# Altium schematic sheet lipo-supply.SchDoc
size A
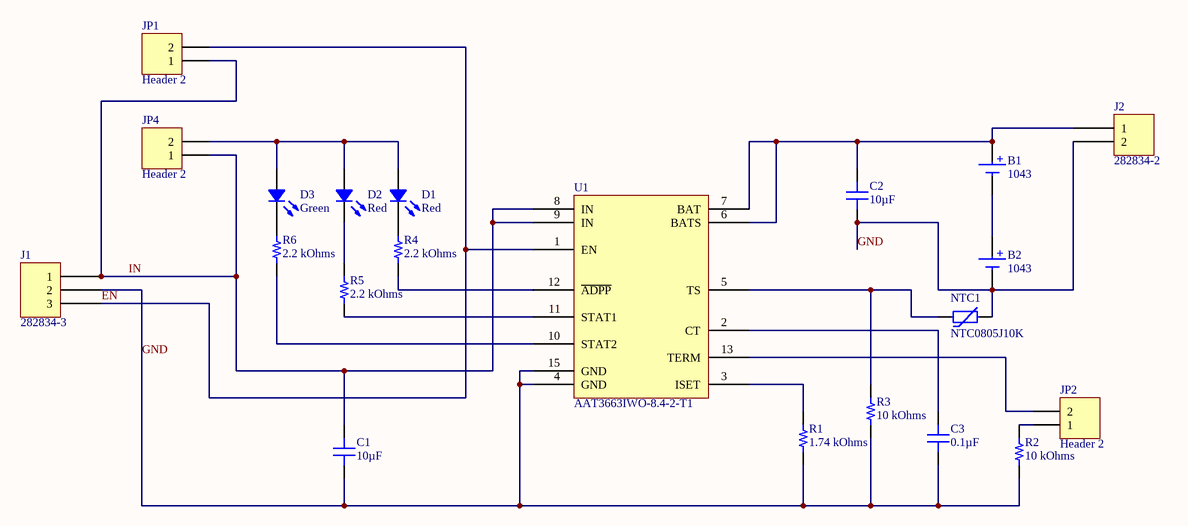
[diagram p0: lipo-supply.SchDoc]

## Parts
B1  1043  [KEYSTONE 1043]
B2  1043  [KEYSTONE 1043]
C1  10µF  [CAP 1210_3225 - 2.8MM]
C2  10µF  [CAP 0805_2012]
C3  0.1µF  [CAP 0805_2012]
D1  Red  [LED 0805_2012 RED]
D2  Red  [LED 0805_2012 RED]
D3  Green  [LED 0805_2012 GREEN]
J1  282834-3  [TE 282834-3]
J2  282834-2  [TE 282834-2]
JP1  Header 2  [HDR1X2]
JP2  Header 2  [HDR1X2]
JP4  Header 2  [HDR1X2]
NTC1  NTC0805J10K  [NTC 0805_2012]
R1  1.74 kOhms  [RES 0805_2012]
R2  10 kOhms  [RES 0805_2012]
R3  10 kOhms  [RES 0805_2012]
R4  2.2 kOhms  [RES 0805_2012]
R5  2.2 kOhms  [RES 0805_2012]
R6  2.2 kOhms  [RES 0805_2012]
U1  AAT3663IWO-8.4-2-T1  [SKYWORKS TDFN-14 3X3MM]

## Nets
EN: J1.3 JP1.2 U1.1(EN)
GND: B2.2(-) C1.1 C2.1 C3.1 J1.2 J2.2 NTC1.2 R1.1 R2.1 R3.1 U1.4(GND) U1.15(GND)
IN: C1.2 J1.1 JP1.1 JP4.1 U1.8(IN) U1.9(IN)
NetB1_1: B1.1(+) C2.2 J2.1 U1.6(BATS) U1.7(BAT)
NetB1_2: B1.2(-) B2.1(+)
NetC3_2: C3.2 U1.2(CT)
NetD1_1: D1.1 D2.1 D3.1 JP4.2
NetD1_2: D1.2 R4.2
NetD2_2: D2.2 R5.2
NetD3_2: D3.2 R6.2
NetJP2_1: JP2.1 R2.2
NetJP2_2: JP2.2 U1.13(TERM)
NetNTC1_1: NTC1.1 R3.2 U1.5(TS)
NetR1_2: R1.2 U1.3(ISET)
NetR4_1: R4.1 U1.12(~{ADPP})
NetR5_1: R5.1 U1.11(STAT1)
NetR6_1: R6.1 U1.10(STAT2)

## Library data of the parts
B1 B2 = 1043: BATTERY HOLDER 18650 PC PIN; Manufacturer: Keystone Electronics; Battery Cell Size: 18650; Battery Type, Function: Cylindrical, Holder; Number of Cells: 1; Style: Holder (Open); Part Number: 1043; ComponentLink1Description: Datasheet; ComponentLink1URL: http://keyelco.com/userAssets/file/M65p27.pdf; ComponentLink2Description: DigiKey Link; ComponentLink2URL: http://digikey.com/product-detail/en/keystone-electronics/1043/36-1043-ND/2745669; Height Above Board: 0.585" (14.86mm); LastUpdated: 2/2/2020 9:19:56 AM; Lifecycle Status: Active; Minimum Order: 1; Mounting Type: PCB, Through Hole; Operating Temperature: -50°C ~ 145°C; Packaging: Unknown; PartId: 2; Part Status: Active; Price: 2.58; Series: -; Supplier 1: DigiKey; Supplier Part Number 1: 36-1043-ND; Termination Style: PC Pin
C1 = GCG32ER71E106KA12L: CAP CER 10UF 25V X7R 1210 EPOXY; Manufacturer: Murata Electronics; Tolerance: ±10%; Part Number: GCG32ER71E106KA12L; Value: 10µF; Applications: Automotive; Capacitance: 10µF; ComponentLink1Description: Datasheet; ComponentLink1URL: https://search.murata.co.jp/Ceramy/image/img/A01X/G101/ENG/GCG32ER71E106KA12-01.pdf; ComponentLink2Description: DigiKey Link; ComponentLink2URL: http://digikey.com/product-detail/en/murata-electronics/GCG32ER71E106KA12L/490-18199-1-ND/9867928; Device Package: 1210 (3225 Metric); LastUpdated: 1/21/2020 12:30:50 AM; Lifecycle Status: Active; Minimum Order: 1; Mounting Type: Surface Mount, MLCC, Epoxy; Operating Temperature: -55°C ~ 125°C; Package / Case: 1210 (3225 Metric); Packaging: TapeAndReel; PartId: 23619; Part Status: Active; Price: 0.52; Series: GCG; Size / Dimension: 0.126" L x 0.098" W (3.20mm x 2.50mm); Supplier 1: DigiKey; Supplier Part Number 1: 490-18199-1-ND; Temperature Coefficient: X7R; Thickness (Max): 0.110" (2.80mm); Voltage - Rated: 25V; Features: Epoxy Mountable; Ratings: AEC-Q200
C2 = EMK212BB7106MG-T: CAP CER 10UF 16V X7R 0805; Manufacturer: Taiyo Yuden; Tolerance: ±20%; Part Number: EMK212BB7106MG-T; Value: 10µF; Applications: General Purpose; Capacitance: 10µF; ComponentLink1Description: Datasheet; ComponentLink1URL: http://www.yuden.co.jp/productdata/catalog/mlcc06_e.pdf; ComponentLink2Description: DigiKey Link; ComponentLink2URL: http://digikey.com/product-detail/en/taiyo-yuden/EMK212BB7106MG-T/587-3319-1-ND/4157364; Device Package: 0805 (2012 Metric); LastUpdated: 1/21/2020 12:03:05 AM; Lifecycle Status: Active; Minimum Order: 1; Mounting Type: Surface Mount, MLCC; Operating Temperature: -55°C ~ 125°C; Package / Case: 0805 (2012 Metric); Packaging: TapeAndReel; PartId: 3069; Part Status: Active; Price: 0.11; Series: M; Size / Dimension: 0.079" L x 0.049" W (2.00mm x 1.25mm); Supplier 1: DigiKey; Supplier Part Number 1: 587-3319-1-ND; Temperature Coefficient: X7R; Thickness (Max): 0.053" (1.35mm); Voltage - Rated: 16V
C3 = 0805B104K160CT: CAP CER 0.1UF 16V X7R 0805; Manufacturer: Walsin Technology Corporation; Tolerance: ±10%; Part Number: 0805B104K160CT; Value: 0.1µF; Applications: General Purpose; Capacitance: 0.1µF; ComponentLink1Description: Datasheet; ComponentLink1URL: http://www.passivecomponent.com/wp-content/uploads/2018/10/MLCC.pdf; ComponentLink2Description: DigiKey Link; ComponentLink2URL: http://digikey.com/product-detail/en/walsin-technology-corporation/0805B104K160CT/1292-1565-1-ND/9355569; Device Package: 0805 (2012 Metric); LastUpdated: 1/21/2020 12:03:02 AM; Lifecycle Status: Active; Minimum Order: 1; Mounting Type: Surface Mount, MLCC; Operating Temperature: -55°C ~ 125°C; Package / Case: 0805 (2012 Metric); Packaging: TapeAndReel; PartId: 4882; Part Status: Active; Price: 0.02; Series: -; Size / Dimension: 0.079" L x 0.049" W (2.00mm x 1.25mm); Supplier 1: DigiKey; Supplier Part Number 1: 1292-1565-1-ND; Temperature Coefficient: X7R; Thickness (Max): 0.035" (0.90mm); Voltage - Rated: 16V
D1 D2 = 5990110007F: LED RED 0805 SMD; Manufacturer: Dialight; Configuration: Standard; Current - Test: 20mA; Lens Color: 0.80mm; Lens Size: 1.40mm x 1.25mm; Lens Style: Rectangle with Flat Top; Millicandela Rating: 29mcd; Viewing Angle: 140°; Voltage - Forward (Vf) (Typ): 2.1V; Wavelength - Dominant: 633nm; Part Number: 5990110007F; Color: Red; ComponentLink1Description: Datasheet; ComponentLink1URL: http://www.dialightsignalsandcomponents.com/Assets/Brochures_And_Catalogs/Indication/CBI_SMD_new/Dialight_CBI_data_599-0805_Apr2018.pdf; ComponentLink2Description: DigiKey Link; ComponentLink2URL: http://digikey.com/product-detail/en/dialight/5990110007F/350-4353-1-ND/9385459; Device Package: 0805 (2012 Metric); Height (Max): 0.80mm; LastUpdated: 1/21/2020 3:13:52 AM; Lifecycle Status: Active; Minimum Order: 1; Mounting Type: Surface Mount; Package / Case: 0805 (2012 Metric); Packaging: TapeAndReel; PartId: 308; Part Status: Active; Price: 0.07; Series: 599; Size / Dimension: 2.00mm L x 1.25mm W; Supplier 1: DigiKey; Supplier Part Number 1: 350-4353-1-ND; Supplier Device Package: 0805; Value: Red
D3 = 5975316507F: LED GREEN 0805 SMD; Manufacturer: Dialight; Configuration: Standard; Current - Test: 20mA; Lens Color: 0.93mm; Lens Size: 1.40mm x 1.24mm; Lens Style: Rectangle with Flat Top; Millicandela Rating: 16mcd; Voltage - Forward (Vf) (Typ): 2.2V; Wavelength - Dominant: 560nm; Part Number: 5975316507F; Color: Green; ComponentLink1Description: Datasheet; ComponentLink1URL: http://www.dialightsignalsandcomponents.com/Assets/Drawings/2D_Drawings_DrawingDetailedSpec/NewDrawings/18370A.pdf; ComponentLink2Description: DigiKey Link; ComponentLink2URL: http://digikey.com/product-detail/en/dialight/5975316507F/350-4389-1-ND/9385495; Device Package: 0805 (2012 Metric); Height (Max): 0.93mm; LastUpdated: 1/21/2020 3:14:10 AM; Lifecycle Status: Active; Minimum Order: 1; Mounting Type: Surface Mount; Package / Case: 0805 (2012 Metric); Packaging: TapeAndReel; PartId: 245; Part Status: Active; Price: 0.15; Series: 597; Size / Dimension: 2.00mm L x 1.25mm W; Supplier 1: DigiKey; Supplier Part Number 1: 350-4389-1-ND; Supplier Device Package: 0805; Value: Green
J1 = 282834-3: TERM BLK 3P SIDE ENT 2.54MM PCB; Manufacturer: TE Connectivity AMP Connectors; Current: 10A; Mating Orientation: Horizontal with Board; Number of Levels: 1; Pitch: 0.100" (2.54mm); Positions Per Level: 3; Voltage: 150V; Wire Gauge: 16-30 AWG; Wire Termination: Screw - Rising Cage Clamp; Part Number: 282834-3; Color: Green; ComponentLink1Description: Datasheet; ComponentLink1URL: https://www.te.com/commerce/DocumentDelivery/DDEController?Action=srchrtrv&DocNm=282834&DocType=Customer+Drawing&DocLang=English; ComponentLink2Description: DigiKey Link; ComponentLink2URL: http://digikey.com/product-detail/en/te-connectivity-amp-connectors/282834-3/A98334-ND/1153264; LastUpdated: 1/15/2020 4:15:50 AM; Lifecycle Status: Active; Minimum Order: 1; Mounting Type: Through Hole; Packaging: Bulk; Part Status: Active; Price: 2.01; Series: Buchanan; Supplier 1: DigiKey; Supplier Part Number 1: A98334-ND
J2 = 282834-2: TERM BLK 2P SIDE ENT 2.54MM PCB; Manufacturer: TE Connectivity AMP Connectors; Current: 10A; Mating Orientation: Horizontal with Board; Number of Levels: 1; Pitch: 0.100" (2.54mm); Positions Per Level: 2; Voltage: 150V; Wire Gauge: 16-30 AWG; Wire Termination: Screw - Rising Cage Clamp; Part Number: 282834-2; Color: Green; ComponentLink1Description: Datasheet; ComponentLink1URL: https://www.te.com/commerce/DocumentDelivery/DDEController?Action=srchrtrv&DocNm=282834&DocType=Customer+Drawing&DocLang=English; ComponentLink2Description: DigiKey Link; ComponentLink2URL: http://digikey.com/product-detail/en/te-connectivity-amp-connectors/282834-2/A98333-ND/1150135; LastUpdated: 1/15/2020 4:15:38 AM; Lifecycle Status: Active; Minimum Order: 1; Mounting Type: Through Hole; Packaging: Bulk; Part Status: Active; Price: 0.88; Series: Buchanan; Supplier 1: DigiKey; Supplier Part Number 1: A98333-ND
JP1 JP2 JP4 = Header 2: Header, 2-Pin; LatestRevisionDate: 17-Jul-2002; LatestRevisionNote: Re-released for DXP Platform.; Publisher: Altium Limited
NTC1 = NTC0805J10K: THERMISTOR NTC 10KOHM 0805; Manufacturer: TE Connectivity Passive Product; B Value Tolerance: ±5%; Power - Max: 125mW; Resistance in Ohms @ 25°C: 10k; Part Number: NTC0805J10K; ComponentLink1Description: Datasheet; ComponentLink1URL: https://www.te.com/commerce/DocumentDelivery/DDEController?Action=srchrtrv&DocNm=1624345&DocType=Customer+Drawing&DocLang=English; ComponentLink2Description: DigiKey Link; ComponentLink2URL: http://digikey.com/product-detail/en/te-connectivity-passive-product/NTC0805J10K/A106104CT-ND/3477761; Device Package: 0805 (2012 Metric); LastUpdated: 1/21/2020 3:31:41 AM; Lifecycle Status: Active; Minimum Order: 1; Mounting Type: Surface Mount; Operating Temperature: -55°C ~ 125°C; Package / Case: 0805 (2012 Metric); Packaging: TapeAndReel; PartId: 574; Part Status: Active; Price: 0.40; Resistance Tolerance: ±5%; Series: Neohm; Supplier 1: DigiKey; Supplier Part Number 1: A106104CT-ND
R1 = KTR10EZPF1741: RES SMD 1.74K OHM 1% 1/8W 0805; Manufacturer: Rohm Semiconductor; Power (Watts): 0.125W, 1/8W; Temperature Coefficient: ±100ppm/°C; Part Number: KTR10EZPF1741; Value: 1.74 kOhms; ComponentLink1Description: Datasheet; ComponentLink1URL: https://www.rohm.com/datasheet/KTR03EZPF/ktr-e; ComponentLink2Description: DigiKey Link; ComponentLink2URL: http://digikey.com/product-detail/en/rohm-semiconductor/KTR10EZPF1741/RHM1.74KAHCT-ND/4054354; Composition: Thick Film; Device Package: 0805 (2012 Metric); Features: Automotive AEC-Q200, High Voltage; Height - Seated (Max): 0.026" (0.65mm); LastUpdated: 1/21/2020 1:49:27 AM; Lifecycle Status: Active; Minimum Order: 1; Number of Terminations: 2; Operating Temperature: -55°C ~ 155°C; Package / Case: 0805 (2012 Metric); Packaging: TapeAndReel; PartId: 29167; Part Status: Active; Price: 0.02; Ratings: AEC-Q200; Resistance: 1.74 kOhms; Series: KTR; Size / Dimension: 0.079" L x 0.049" W (2.00mm x 1.25mm); Supplier 1: DigiKey; Supplier Part Number 1: RHM1.74KAHCT-ND; Supplier Device Package: 0805; Tolerance: ±1%
R2 R3 = RT0805DRD0710KL: RES SMD 10K OHM 0.5% 1/8W 0805; Manufacturer: Yageo; Power (Watts): 0.125W, 1/8W; Temperature Coefficient: ±25ppm/°C; Part Number: RT0805DRD0710KL; Value: 10 kOhms; ComponentLink1Description: Datasheet; ComponentLink1URL: https://www.yageo.com/upload/media/product/productsearch/datasheet/rchip/PYu-RT_1-to-0.01_RoHS_L_11.pdf; ComponentLink2Description: DigiKey Link; ComponentLink2URL: http://digikey.com/product-detail/en/yageo/RT0805DRD0710KL/311-2699-1-ND/6129118; Composition: Thin Film; Device Package: 0805 (2012 Metric); Height - Seated (Max): 0.024" (0.60mm); LastUpdated: 1/21/2020 1:50:02 AM; Lifecycle Status: Active; Minimum Order: 1; Number of Terminations: 2; Operating Temperature: -55°C ~ 155°C; Package / Case: 0805 (2012 Metric); Packaging: TapeAndReel; PartId: 27797; Part Status: Active; Price: 0.03; Resistance: 10 kOhms; Series: RT; Size / Dimension: 0.079" L x 0.049" W (2.00mm x 1.25mm); Supplier 1: DigiKey; Supplier Part Number 1: 311-2699-1-ND; Supplier Device Package: 0805; Tolerance: ±0.5%
R4-R6 = SR0805JR-7W2K2L: RES SMD 2.2K OHM 5% 1/4W 0805; Manufacturer: Yageo; Power (Watts): 0.25W, 1/4W; Temperature Coefficient: ±200ppm/°C; Part Number: SR0805JR-7W2K2L; Value: 2.2 kOhms; ComponentLink1Description: Datasheet; ComponentLink1URL: http://www.yageo.com/documents/recent/PYu-SR_20105_RoHS_L_8.pdf; ComponentLink2Description: DigiKey Link; ComponentLink2URL: http://digikey.com/product-detail/en/yageo/SR0805JR-7W2K2L/YAG6054CT-ND/9696508; Composition: Thick Film; Device Package: 0805 (2012 Metric); Features: Automotive AEC-Q200, Pulse Withstanding; Height - Seated (Max): 0.024" (0.60mm); LastUpdated: 1/21/2020 1:50:02 AM; Lifecycle Status: Active; Minimum Order: 1; Number of Terminations: 2; Operating Temperature: -55°C ~ 155°C; Package / Case: 0805 (2012 Metric); Packaging: TapeAndReel; PartId: 27793; Part Status: Active; Price: 0.03; Ratings: AEC-Q200; Resistance: 2.2 kOhms; Series: SR; Size / Dimension: 0.079" L x 0.049" W (2.00mm x 1.25mm); Supplier 1: DigiKey; Supplier Part Number 1: YAG6054CT-ND; Supplier Device Package: 0805; Tolerance: ±5%
U1 = AAT3663IWO-8.4-2-T1: IC LI-ION CHARGER 14-DFN; Manufacturer: Skyworks Solutions Inc.; Battery Chemistry: Lithium Ion/Polymer; Battery Pack Voltage: 8.4V; Charge Current - Max: 1A; Current - Charging: Constant - Programmable; Fault Protection: Over Current, Over Temperature, Over Voltage, Short Circuit; Interface: USB; Number of Cells: 2; Programmable Features: Current; Voltage - Supply (Max): 13.2V; Part Number: AAT3663IWO-8.4-2-T1; ComponentLink1Description: Datasheet; ComponentLink1URL: http://www.skyworksinc.com/uploads/documents/AAT3663_201878C.pdf; ComponentLink2Description: DigiKey Link; ComponentLink2URL: //digikey.com/product-detail/en/skyworks-solutions-inc/AAT3663IWO-8.4-2-T1/863-1544-2-ND/4753043; Device Package: 14-WFDFN Exposed Pad; LastUpdated: 12/6/2019 2:00:27 AM; Lifecycle Status: 0; Minimum Order: 1; Mounting Type: Surface Mount; Operating Temperature: -40°C ~ 85°C (TA); Package / Case: 14-WFDFN Exposed Pad; Packaging: TapeAndReel; PartId: 23; Part Status: Active; Price: 0.78; Series: BatteryManager™; Supplier 1: DigiKey; Supplier Part Number 1: 863-1544-2-ND; Supplier Device Package: 14-TDFN (3x3)